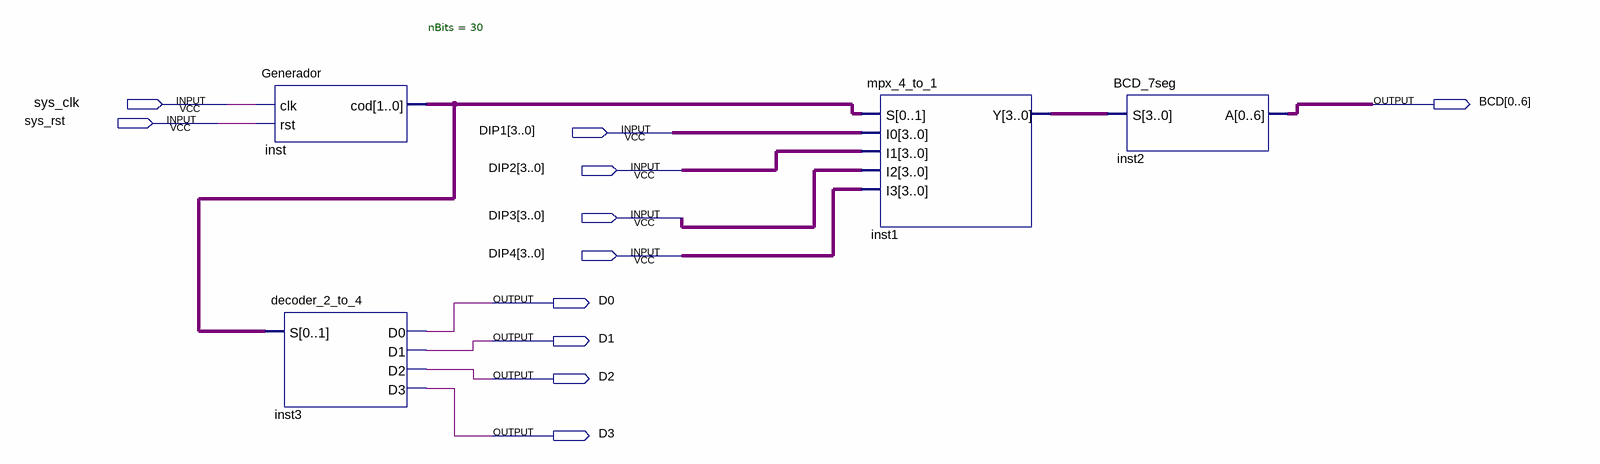
[diagram p0: schematic sheet]
// Quartus schematic P3.bdf as structural Verilog: 4 symbols, 11 pins
module P3 (
  input  sys_clk,
  input  sys_rst,
  input  [3:0] DIP1,
  input  [3:0] DIP2,
  input  [3:0] DIP3,
  input  [3:0] DIP4,
  output [0:6] BCD,
  output D0,
  output D1,
  output D2,
  output D3
);

  wire [1:0] inst_cod;
  wire [3:0] inst1_y;

  Generador #(.nBits(30)) inst (.clk(sys_clk), .rst(sys_rst), .cod(inst_cod));
  decoder_2_to_4 inst3 (.S(inst_cod), .D0(D0), .D1(D1), .D2(D2), .D3(D3));
  mpx_4_to_1 inst1 (.S(inst_cod), .I0(DIP1), .I1(DIP2), .I2(DIP3), .I3(DIP4), .Y(inst1_y));
  BCD_7seg inst2 (.S(inst1_y), .A(BCD));
endmodule
